# EAGLE schematic sensing_unit_rev1 (EAGLE 8.3.2)
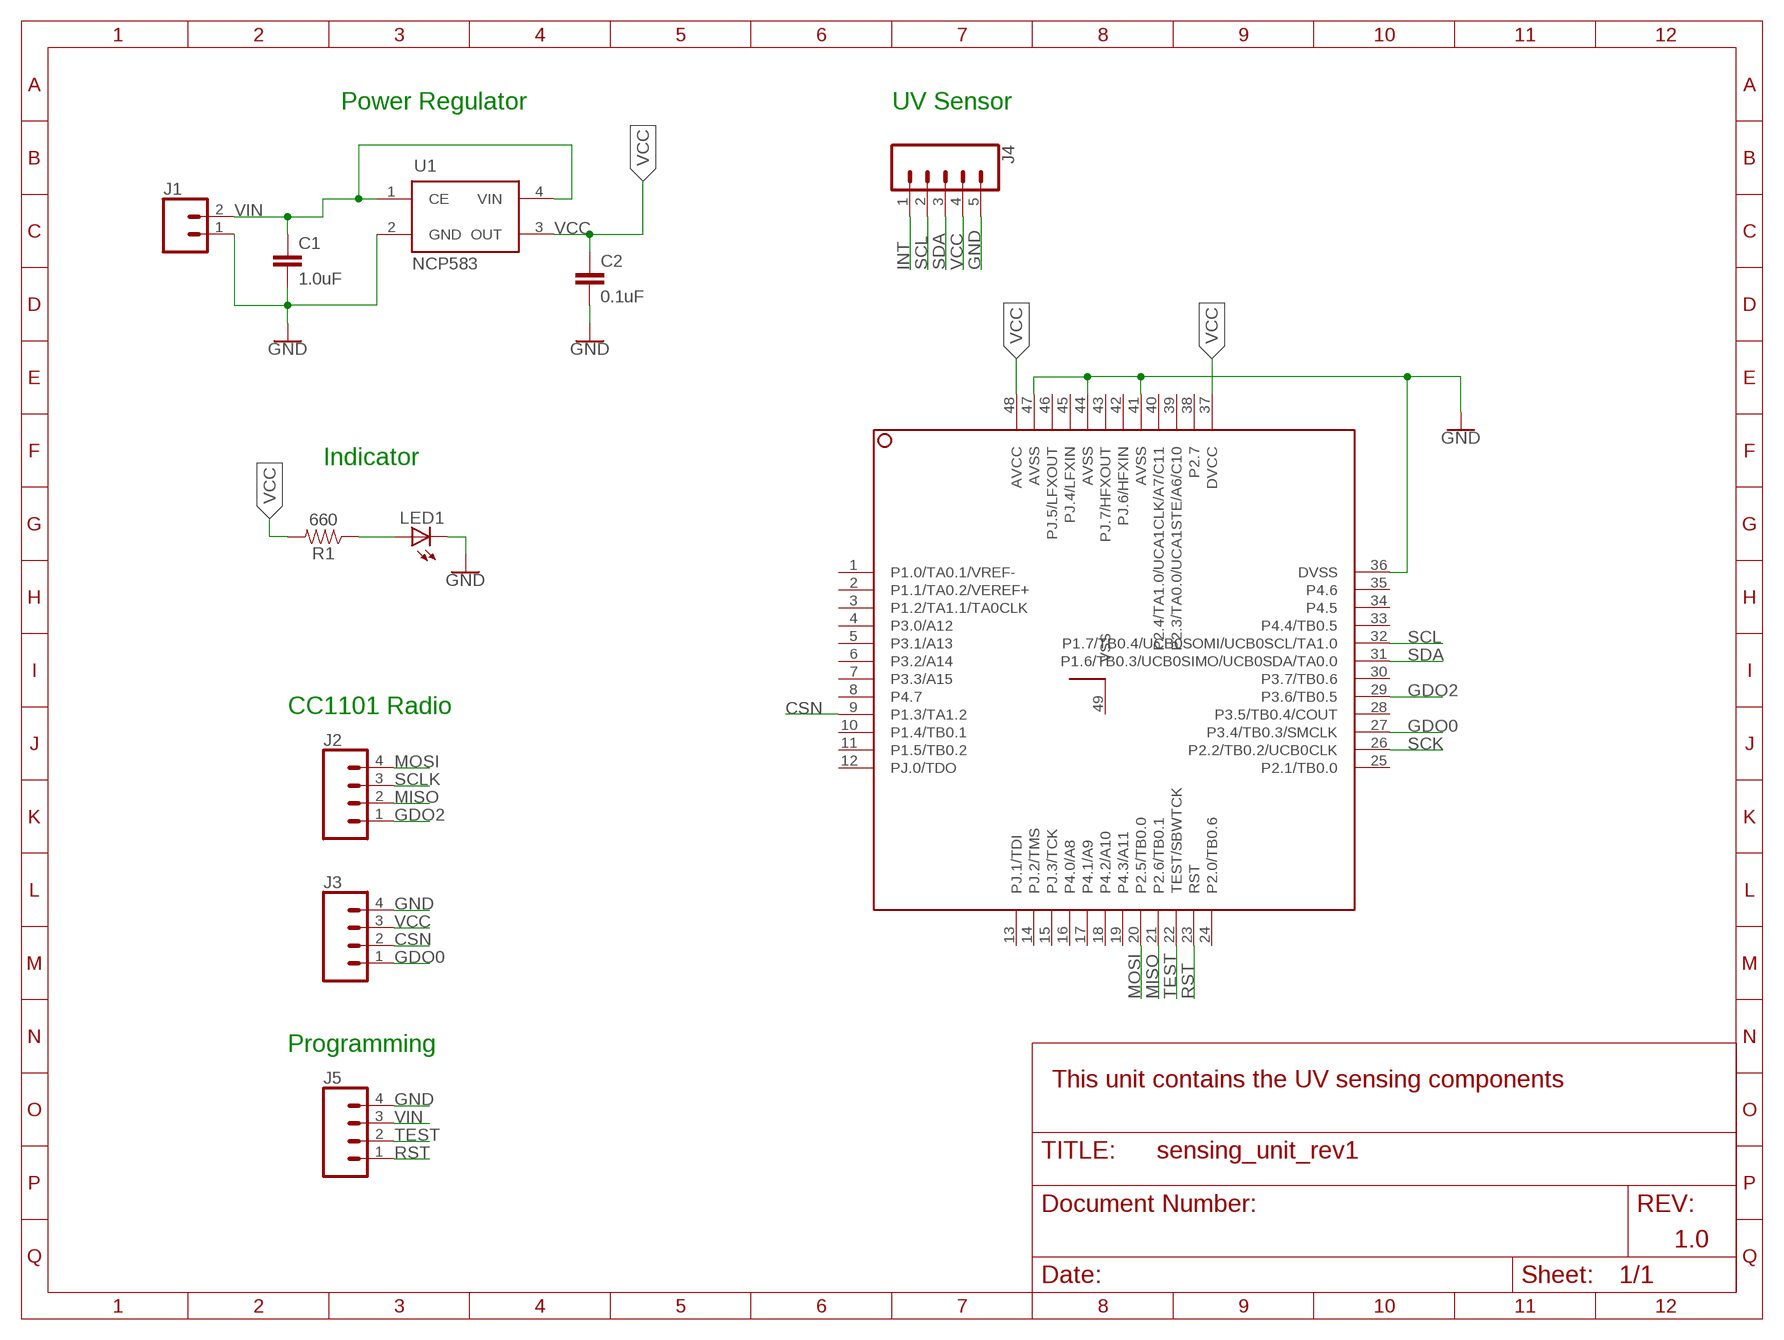
[diagram p0: schematic, sheet 1]

## Parts
C1  1.0uF  1.0UF-0805-25V-(+80/-20%)  [0805]
C2  0.1uF  1.0UF-0805-25V-(+80/-20%)  [0805]
J1  CONN_02  [1X02]
J2  CONN_04  [1X04]
J3  CONN_04  [1X04]
J4  CONN_05  [1X05]
J5  CONN_04  [1X04]
LED1  LEDCHIP-LED0805  [CHIP-LED0805]
R1  660  RESISTOR0805  [0805]
U1  NCP583  [SC82-AB_1PRIMARY]
U2  MSP430FR5969_RGZ_48  [RGZ48_4P1X4P1]

## Nets
CSN: J3.2 U2.9(P1.3/TA1.2)
GDO0: J3.1 U2.27(P3.4/TB0.3/SMCLK)
GDO2: J2.1 U2.29(P3.6/TB0.5)
GND: C1.2 C2.2 J1.1 J3.4 J4.5 J5.4 LED1.C U1.2(GND) U2.36(DVSS) U2.41(AVSS) U2.44(AVSS) U2.47(AVSS)
INT: J4.1
MISO: J2.2 U2.21(P2.6/TB0.1)
MOSI: J2.4 U2.20(P2.5/TB0.0)
N$1: LED1.A R1.1
RST: J5.1 U2.23(RST)
SCK: U2.26(P2.2/TB0.2/UCB0CLK)
SCL: J4.2 U2.32(P1.7/TB0.4/UCB0SOMI/UCB0SCL/TA1.0)
SCLK: J2.3
SDA: J4.3 U2.31(P1.6/TB0.3/UCB0SIMO/UCB0SDA/TA0.0)
TEST: J5.2 U2.22(TEST/SBWTCK)
VCC: C2.1 J3.3 J4.4 R1.2 U1.3(OUT) U2.37(DVCC) U2.48(AVCC)
VIN: C1.1 J1.2 J5.3 U1.1(CE) U1.4(VIN)
Unconnected: U2.1(P1.0/TA0.1/VREF-) U2.2(P1.1/TA0.2/VEREF+) U2.3(P1.2/TA1.1/TA0CLK) U2.4(P3.0/A12) U2.5(P3.1/A13) U2.6(P3.2/A14) U2.7(P3.3/A15) U2.8(P4.7) U2.10(P1.4/TB0.1) U2.11(P1.5/TB0.2) U2.12(PJ.0/TDO) U2.13(PJ.1/TDI) U2.14(PJ.2/TMS) U2.15(PJ.3/TCK) U2.16(P4.0/A8) U2.17(P4.1/A9) U2.18(P4.2/A10) U2.19(P4.3/A11) U2.24(P2.0/TB0.6) U2.25(P2.1/TB0.0) U2.28(P3.5/TB0.4/COUT) U2.30(P3.7/TB0.6) U2.33(P4.4/TB0.5) U2.34(P4.5) U2.35(P4.6) U2.38(P2.7) U2.39(P2.3/TA0.0/UCA1STE/A6/C10) U2.40(P2.4/TA1.0/UCA1CLK/A7/C11) U2.42(PJ.6/HFXIN) U2.43(PJ.7/HFXOUT) U2.45(PJ.4/LFXIN) U2.46(PJ.5/LFXOUT) U2.49(VSS)

## Notes on the sheet
- Power Regulator | UV Sensor
- Indicator
- CC1101 Radio
- Programming
- This unit contains the UV sensing components
- 1.0

## Library data of the parts
C1 = SparkFun-Capacitors:1.0UF: 1µF ceramic capacitors A capacitor is a passive two-terminal electrical component used to store electrical energy temporarily in an electric field.; PROD_ID: CAP-11625
C2 = SparkFun-Capacitors:1.0UF: 1µF ceramic capacitors A capacitor is a passive two-terminal electrical component used to store electrical energy temporarily in an electric field.; PROD_ID: CAP-11625; VALUE: 1.0uF
J1 = SparkFun-Connectors:CONN_02: Multi connection point. Often used as Generic Header-pin footprint for 0.1 inch spaced/style header connections On any of the 0.1 inch spaced packages, you can populate with these: Break Away Headers - Straight <https://www.sparkfun.com/products/116> (PRT-00116) Break Away Male Headers - Right Angle <https://www.sparkfun.com/products/553> (PRT-00553) Female Headers <https://www.sparkfun.com/products/115> (PRT-00115) Break Away Headers - Machine Pin <https://www.sparkfun.com/products/117> (PRT-00117) Break Away Female Headers - Swiss Machine Pin <https://www.sparkfun.com/products/743> (PRT-00743) For SCREWTERMINALS and SPRING TERMINALS visit here: Screw Terimnals on SparkFun.com <https://www.sparkfun.com/search/results?term=Screw+Terminals> (5mm/3.5mm/2.54mm spacing) This device is also useful as a general connection point to wire up your design to another part of your project. Our various solder wires solder well into these plated through hole pads. Hook-Up Wire - Assortment (Stranded, 22 AWG) <https://www.sparkfun.com/products/11375> (PRT-11375) Hook-Up Wire - Assortment (Solid Core, 22 AWG) <https://www.sparkfun.com/products/11367> (PRT-11367) View the entire wire category on our website here <https://www.sparkfun.com/categories/141> Special notes: Molex polarized connector foot print use with: PRT-08233 with associated crimp pins and housings. 2.54_SCREWTERM for use with PRT-10571. 3.5mm Screw Terminal footprints for PRT-08084 5mm Screw Terminal footprints for use with PRT-08432
J2 J3 J5 = SparkFun-Connectors:CONN_04: Multi connection point. Often used as Generic Header-pin footprint for 0.1 inch spaced/style header connections On any of the 0.1 inch spaced packages, you can populate with these: Break Away Headers - Straight <https://www.sparkfun.com/products/116> (PRT-00116) Break Away Male Headers - Right Angle <https://www.sparkfun.com/products/553> (PRT-00553) Female Headers <https://www.sparkfun.com/products/115> (PRT-00115) Break Away Headers - Machine Pin <https://www.sparkfun.com/products/117> (PRT-00117) Break Away Female Headers - Swiss Machine Pin <https://www.sparkfun.com/products/743> (PRT-00743) For SCREWTERMINALS and SPRING TERMINALS visit here: Screw Terimnals on SparkFun.com <https://www.sparkfun.com/search/results?term=Screw+Terminals> (5mm/3.5mm/2.54mm spacing) This device is also useful as a general connection point to wire up your design to another part of your project. Our various solder wires solder well into these plated through hole pads. Hook-Up Wire - Assortment (Stranded, 22 AWG) <https://www.sparkfun.com/products/11375> (PRT-11375) Hook-Up Wire - Assortment (Solid Core, 22 AWG) <https://www.sparkfun.com/products/11367> (PRT-11367) View the entire wire category on our website here <https://www.sparkfun.com/categories/141> Special notes: Molex polarized connector foot print use with SKU : PRT-08231 with associated crimp pins and housings. 1MM SMD Version SKU: PRT-10208; PROD_ID: CONN-09696
J4 = SparkFun-Connectors:CONN_05: Multi connection point. Often used as Generic Header-pin footprint for 0.1 inch spaced/style header connections On any of the 0.1 inch spaced packages, you can populate with these: Break Away Headers - Straight <https://www.sparkfun.com/products/116> (PRT-00116) Break Away Male Headers - Right Angle <https://www.sparkfun.com/products/553> (PRT-00553) Female Headers <https://www.sparkfun.com/products/115> (PRT-00115) Break Away Headers - Machine Pin <https://www.sparkfun.com/products/117> (PRT-00117) Break Away Female Headers - Swiss Machine Pin <https://www.sparkfun.com/products/743> (PRT-00743) For SCREWTERMINALS and SPRING TERMINALS visit here: Screw Terimnals on SparkFun.com <https://www.sparkfun.com/search/results?term=Screw+Terminals> (5mm/3.5mm/2.54mm spacing) This device is also useful as a general connection point to wire up your design to another part of your project. Our various solder wires solder well into these plated through hole pads. Hook-Up Wire - Assortment (Stranded, 22 AWG) <https://www.sparkfun.com/products/11375> (PRT-11375) Hook-Up Wire - Assortment (Solid Core, 22 AWG) <https://www.sparkfun.com/products/11367> (PRT-11367) View the entire wire category on our website here <https://www.sparkfun.com/categories/141> Special notes: Molex polarized connector foot print use with SKU : PRT-08231 with associated crimp pins and housings. 1MM SMD Version SKU: PRT-10208
LED1 = led:LED: LED OSRAM: - CHIPLED LG R971, LG N971, LY N971, LG Q971, LY Q971, LO R971, LY R971 LH N974, LH R974 LS Q976, LO Q976, LY Q976 LO Q996 - Hyper CHIPLED LW Q18S LB Q993, LB Q99A, LB R99A - SideLED LS A670, LO A670, LY A670, LG A670, LP A670 LB A673, LV A673, LT A673, LW A673 LH A674 LY A675 LS A676, LA A676, LO A676, LY A676, LW A676 LS A679, LY A679, LG A679 - Hyper Micro SIDELED® LS Y876, LA Y876, LO Y876, LY Y876 LT Y87S - SmartLED LW L88C, LW L88S LB L89C, LB L89S, LG L890 LS L89K, LO L89K, LY L89K LS L896, LA L896, LO L896, LY L896 - TOPLED LS T670, LO T670, LY T670, LG T670, LP T670 LSG T670, LSP T670, LSY T670, LOP T670, LYG T670 LG T671, LOG T671, LSG T671 LB T673, LV T673, LT T673, LW T673 LH T674 LS T676, LA T676, LO T676, LY T676, LB T676, LH T676, LSB T676, LW T676 LB T67C, LV T67C, LT T67C, LS T67K, LO T67K, LY T67K, LW E67C LS E67B, LA E67B, LO E67B, LY E67B, LB E67C, LV E67C, LT E67C LW T67C LS T679, LY T679, LG T679 LS T770, LO T770, LY T770, LG T770, LP T770 LB T773, LV T773, LT T773, LW T773 LH T774 LS E675, LA E675, LY E675, LS T675 LS T776, LA T776, LO T776, LY T776, LB T776 LHGB T686 LT T68C, LB T68C - Hyper Mini TOPLED® LB M676 - Mini TOPLED Santana® LG M470 LS M47K, LO M47K, LY M47K Source: http://www.osram.convergy.de LUXEON: - LUMILED® LXK2-PW12-R00, LXK2-PW12-S00, LXK2-PW14-U00, LXK2-PW14-V00 LXK2-PM12-R00, LXK2-PM12-S00, LXK2-PM14-U00 LXK2-PE12-Q00, LXK2-PE12-R00, LXK2-PE12-S00, LXK2-PE14-T00, LXK2-PE14-U00 LXK2-PB12-K00, LXK2-PB12-L00, LXK2-PB12-M00, LXK2-PB14-N00, LXK2-PB14-P00, LXK2-PB14-Q00 LXK2-PR12-L00, LXK2-PR12-M00, LXK2-PR14-Q00, LXK2-PR14-R00 LXK2-PD12-Q00, LXK2-PD12-R00, LXK2-PD12-S00 LXK2-PH12-R00, LXK2-PH12-S00 LXK2-PL12-P00, LXK2-PL12-Q00, LXK2-PL12-R00 Source: www.luxeon.com KINGBRIGHT: KA-3528ASYC Source: www.kingbright.com
R1 = SparkFun-Resistors:RESISTOR: Generic Resistor Package
U1 = ncp583:NCP583: NCP583 - Ultra-Low Iq 150 mA CMOS LDO Regulator with Enable The NCP583 series of low dropout regulators are designed for portable battery powered applications which require precise output voltage accuracy and low quiescent current. These devices feature an enable function which lowers current consumption significantly and are offered in two small packages; SC−82AB and the SOT−563. A 1.0 mF ceramic capacitor is the recommended value to be used with these devices on the output pin.
U2 = msp430:MSP430FR5969_RGZ_48: MSP430FR59xx Mixed Signal Microcontroller Package: RGZ-S-PQVFN-N48 (MSP430FR596x and MSP430FR586x) Description The Texas Instruments MSP430FR58xx and MSP430FR59xx family of ultralow-power microcontrollers consists of several devices featuring embedded FRAM nonvolatile memory, an ultralow-power 16-bit MSP430 CPU, and different sets of peripherals targeted for various applications. The architecture, FRAM, and peripherals, combined with seven low-power modes, are optimized to achieve extended battery life in portable and wireless sensing applications. FRAM is a new nonvolatile memory that combines the speed, flexibility, and endurance of SRAM with the stability and reliability of flash, all at lower total power consumption.; MANUFACTURER_PART_NUMBER: msp430fr5969_rgz_48; VENDOR: Texas Instruments